# EAGLE schematic main_brd (EAGLE 6.4)
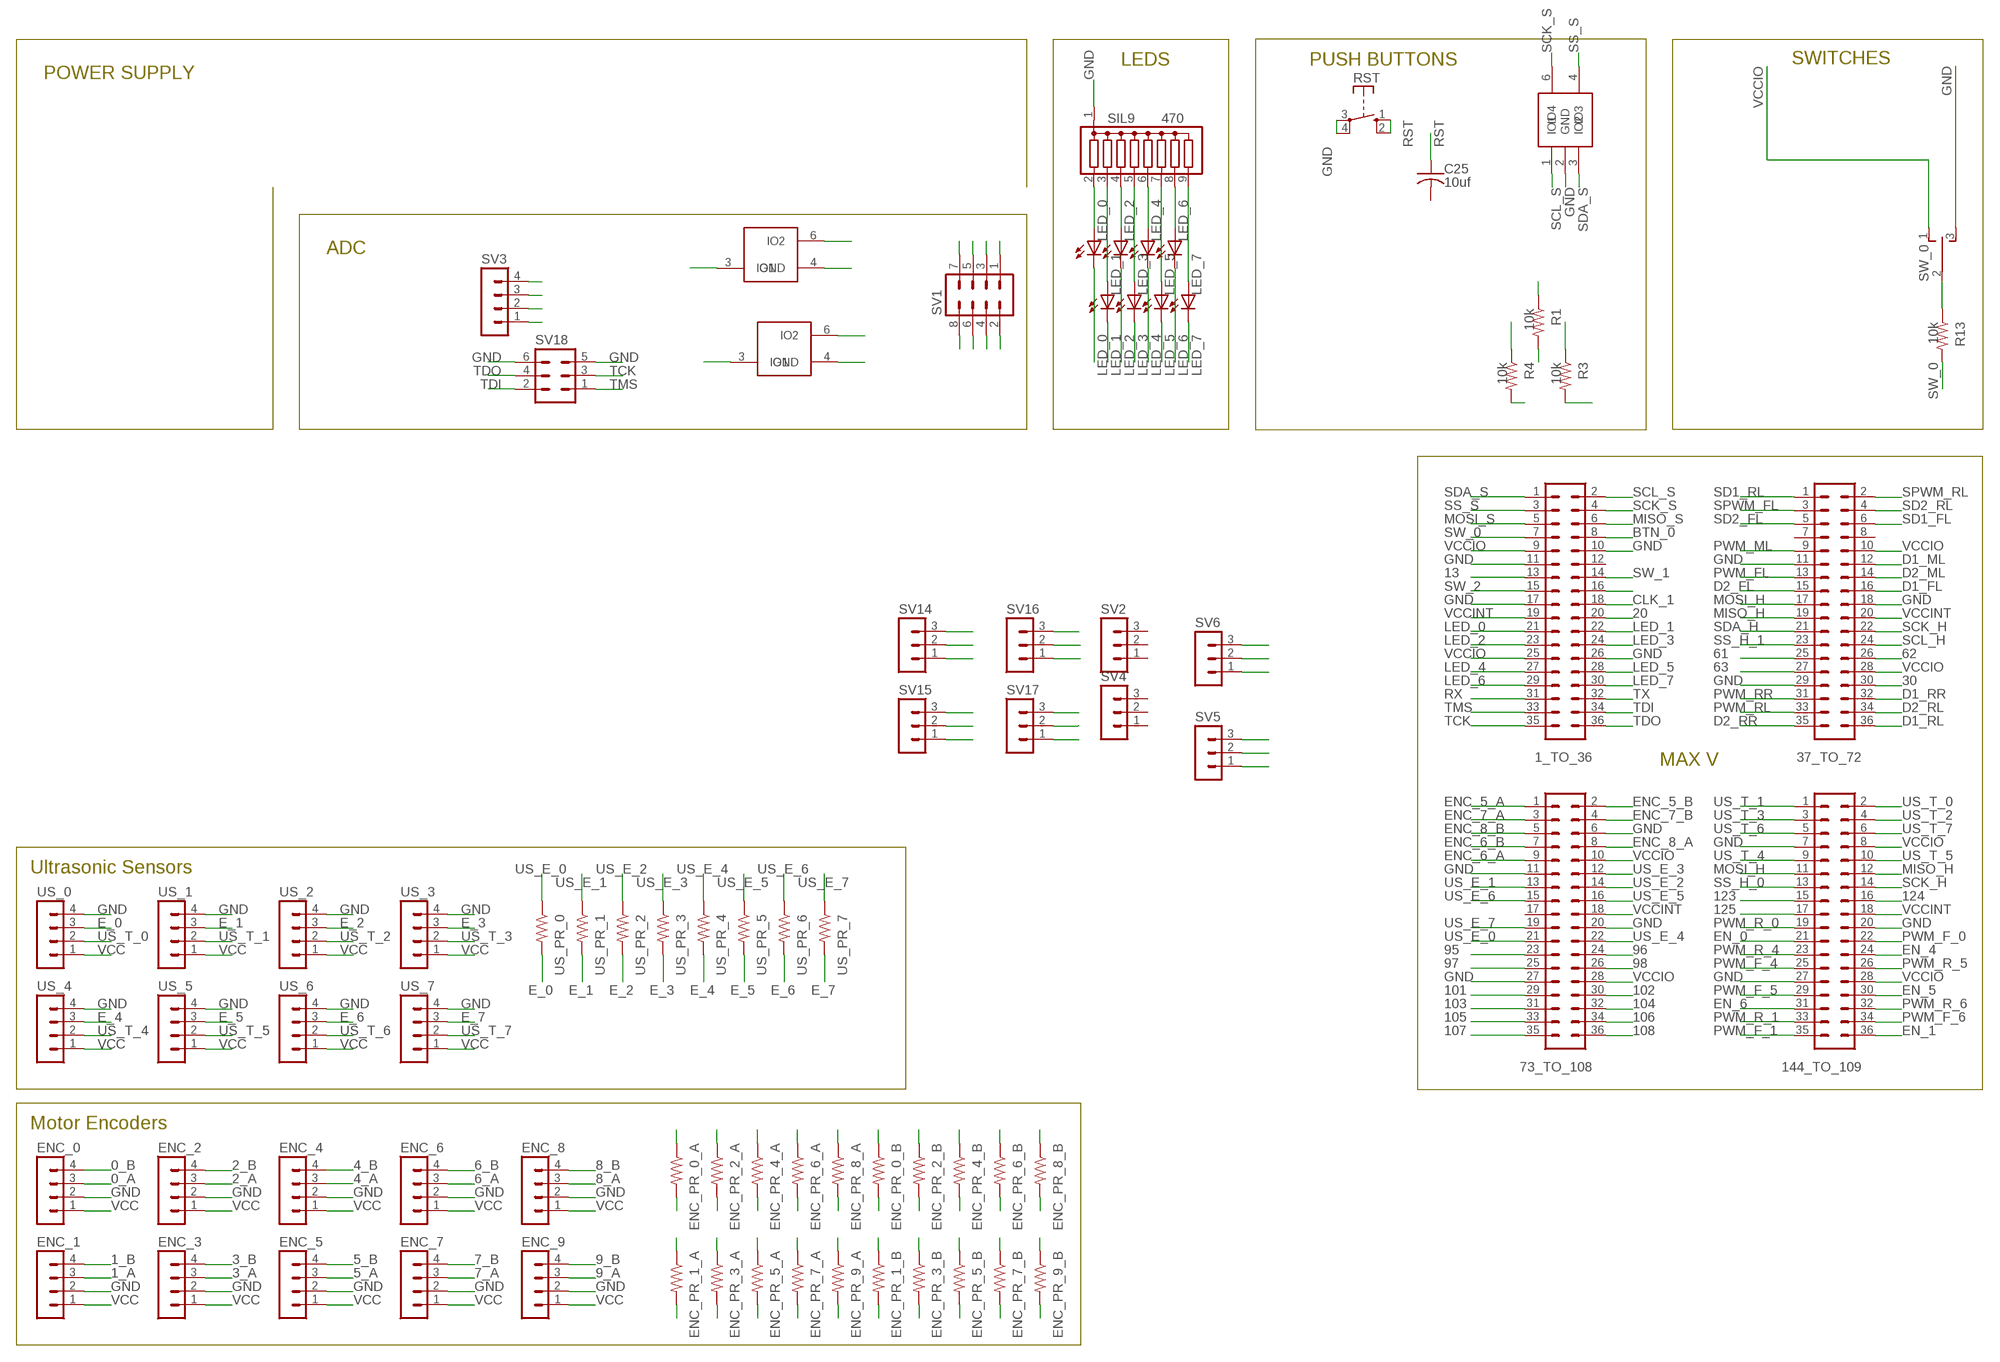
[diagram p0: schematic, sheet 1, part 1 of 2]
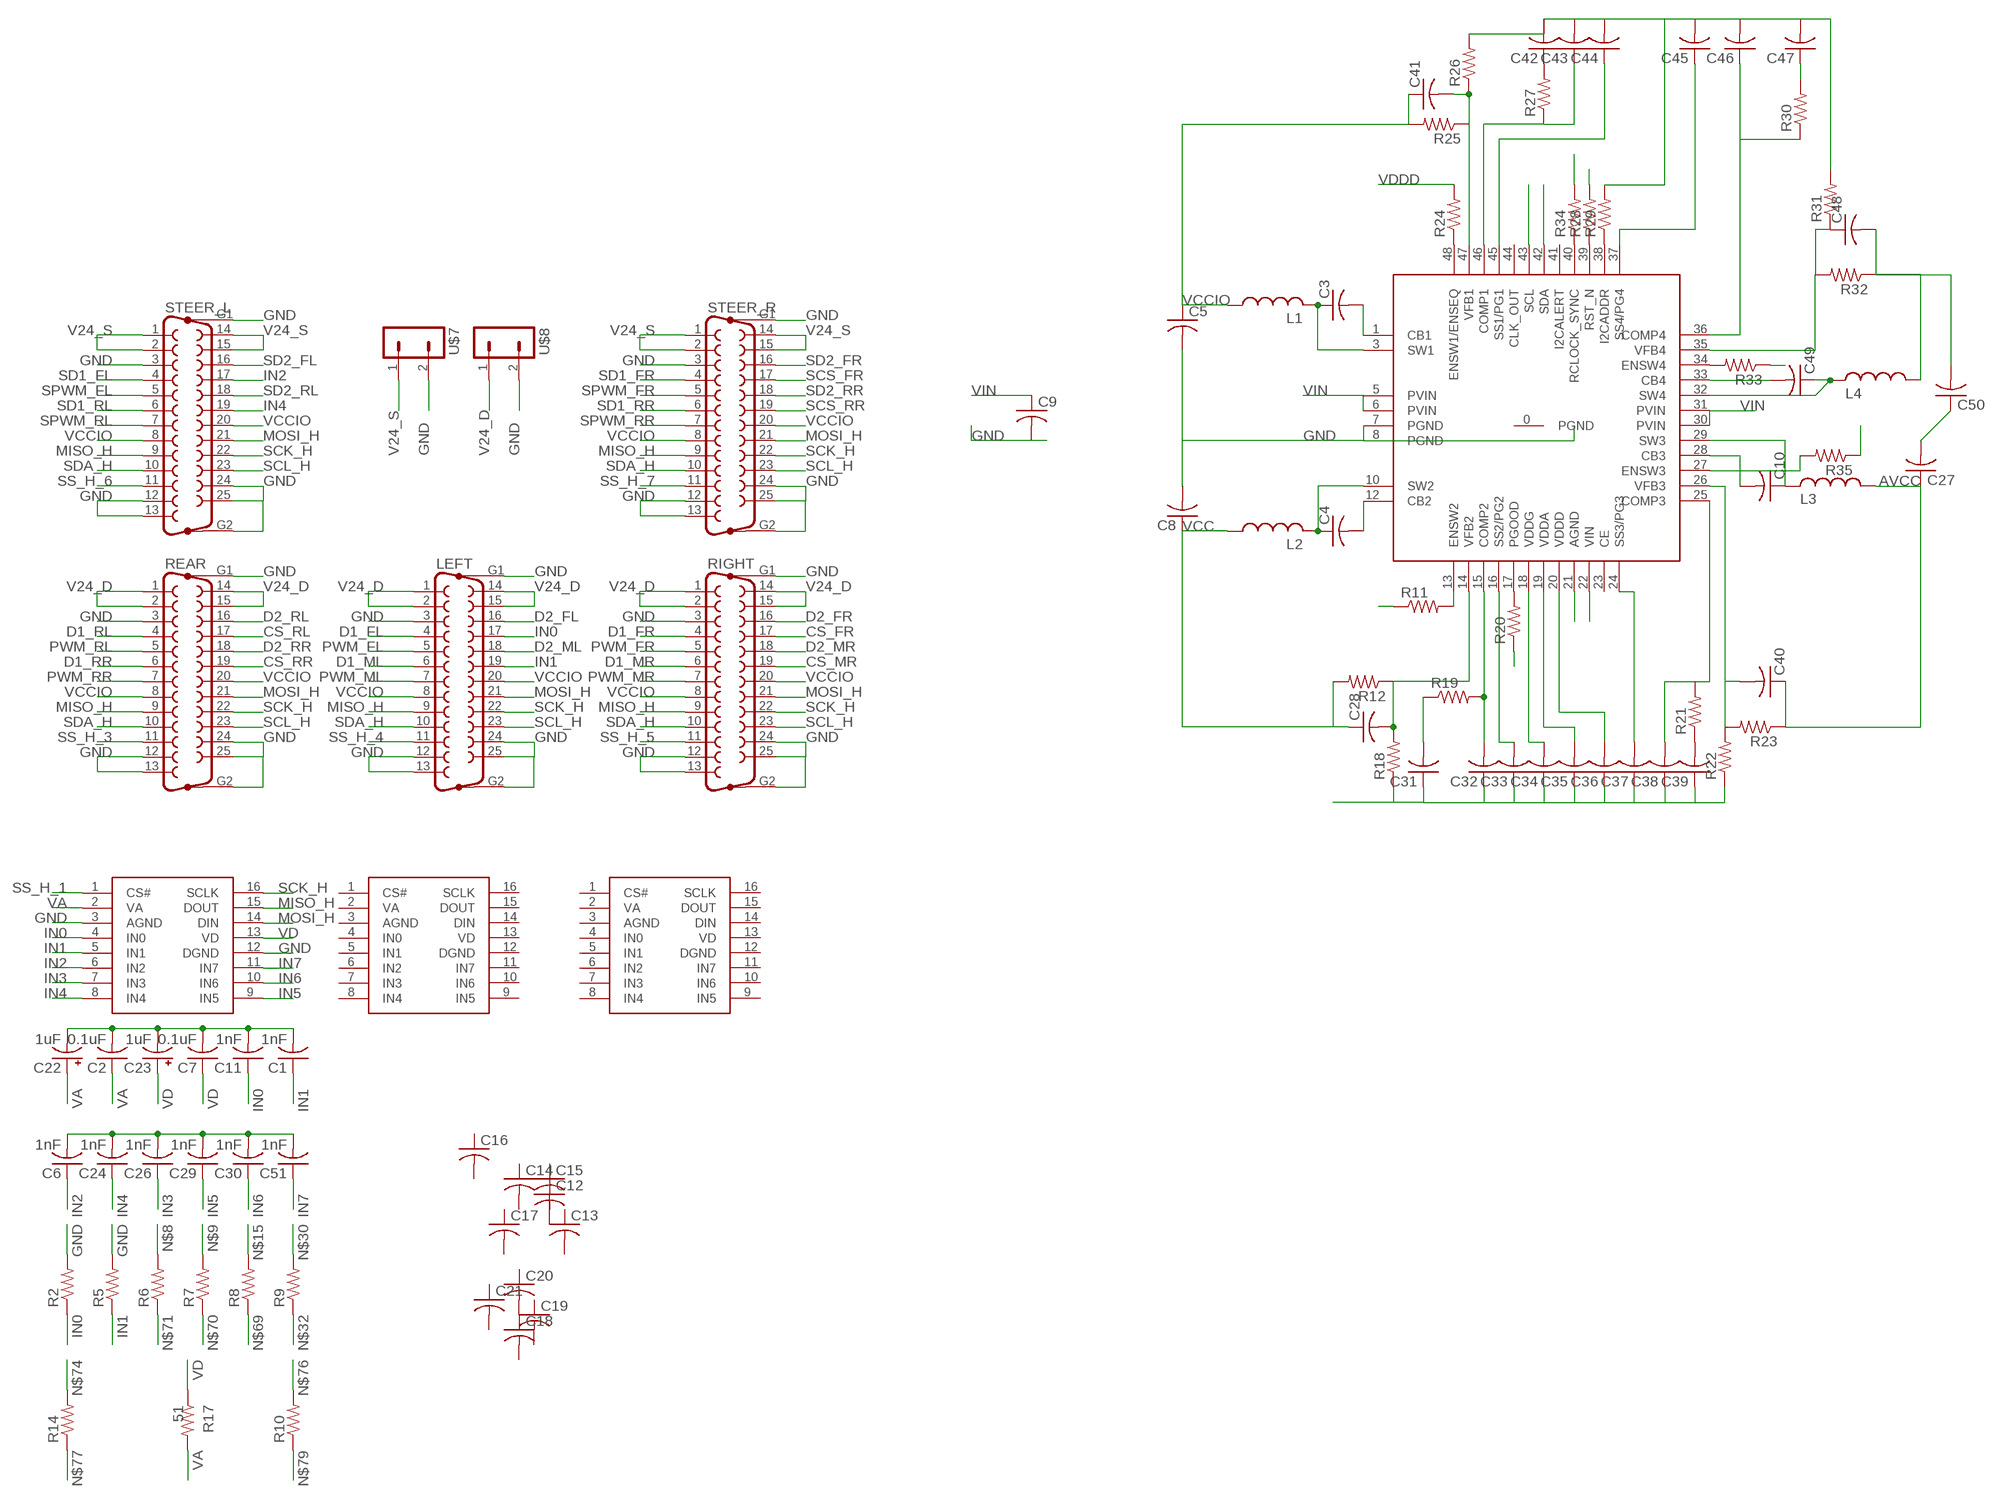
[diagram p1: schematic, sheet 1, part 2 of 2]

## Parts
1_TO_36  MA18-2  [MA18-2]
37_TO_72  MA18-2  [MA18-2]
73_TO_108  MA18-2  [MA18-2]
144_TO_109  MA18-2  [MA18-2]
C1  1nF  C-USC1206  [C1206]
C2  0.1uF  C-USC1206  [C1206]
C3  C-USC1206  [C1206]
C4  C-USC1206  [C1206]
C5  C-USC1206  [C1206]
C6  1nF  C-USC1206  [C1206]
C7  0.1uF  C-USC1206  [C1206]
C8  C-USC1206  [C1206]
C9  C-USC1206  [C1206]
C10  C-USC1206  [C1206]
C11  1nF  C-USC1206  [C1206]
C12  C-USC1206  [C1206]
C13  C-USC1206  [C1206]
C14  C-USC1206  [C1206]
C15  C-USC1206  [C1206]
C16  C-USC1206  [C1206]
C17  C-USC1206  [C1206]
C18  C-USC1206  [C1206]
C19  C-USC1206  [C1206]
C20  C-USC1206  [C1206]
C21  C-USC1206  [C1206]
C22  1uF  CPOL-USE1.8-4  [E1,8-4]
C23  1uF  CPOL-USE1.8-4  [E1,8-4]
C24  1nF  C-USC1206  [C1206]
C25  10uf  C-USC1206  [C1206]
C26  1nF  C-USC1206  [C1206]
C27  C-USC1206  [C1206]
C28  C-USC1206  [C1206]
C29  1nF  C-USC1206  [C1206]
C30  1nF  C-USC1206  [C1206]
C31  C-USC1206  [C1206]
C32  C-USC1206  [C1206]
C33  C-USC1206  [C1206]
C34  C-USC1206  [C1206]
C35  C-USC1206  [C1206]
C36  C-USC1206  [C1206]
C37  C-USC1206  [C1206]
C38  C-USC1206  [C1206]
C39  C-USC1206  [C1206]
C40  C-USC1206  [C1206]
C41  C-USC1206  [C1206]
C42  C-USC1206  [C1206]
C43  C-USC1206  [C1206]
C44  C-USC1206  [C1206]
C45  C-USC1206  [C1206]
C46  C-USC1206  [C1206]
C47  C-USC1206  [C1206]
C48  C-USC1206  [C1206]
C49  C-USC1206  [C1206]
C50  C-USC1206  [C1206]
C51  1nF  C-USC1206  [C1206]
ENC_0  MA04-1  [MA04-1]
ENC_1  MA04-1  [MA04-1]
ENC_2  MA04-1  [MA04-1]
ENC_3  MA04-1  [MA04-1]
ENC_4  MA04-1  [MA04-1]
ENC_5  MA04-1  [MA04-1]
ENC_6  MA04-1  [MA04-1]
ENC_7  MA04-1  [MA04-1]
ENC_8  MA04-1  [MA04-1]
ENC_9  MA04-1  [MA04-1]
ENC_PR_0_A  R-US_R1206  [R1206]
ENC_PR_0_B  R-US_R1206  [R1206]
ENC_PR_1_A  R-US_R1206  [R1206]
ENC_PR_1_B  R-US_R1206  [R1206]
ENC_PR_2_A  R-US_R1206  [R1206]
ENC_PR_2_B  R-US_R1206  [R1206]
ENC_PR_3_A  R-US_R1206  [R1206]
ENC_PR_3_B  R-US_R1206  [R1206]
ENC_PR_4_A  R-US_R1206  [R1206]
ENC_PR_4_B  R-US_R1206  [R1206]
ENC_PR_5_A  R-US_R1206  [R1206]
ENC_PR_5_B  R-US_R1206  [R1206]
ENC_PR_6_A  R-US_R1206  [R1206]
ENC_PR_6_B  R-US_R1206  [R1206]
ENC_PR_7_A  R-US_R1206  [R1206]
ENC_PR_7_B  R-US_R1206  [R1206]
ENC_PR_8_A  R-US_R1206  [R1206]
ENC_PR_8_B  R-US_R1206  [R1206]
ENC_PR_9_A  R-US_R1206  [R1206]
ENC_PR_9_B  R-US_R1206  [R1206]
L1  L-USL1206  [C1206]
L2  L-USL1206  [C1206]
L3  L-USL1206  [C1206]
L4  L-USL1206  [C1206]
LED_0  LEDSMT1206  [1206]
LED_1  LEDSMT1206  [1206]
LED_2  LEDSMT1206  [1206]
LED_3  LEDSMT1206  [1206]
LED_4  LEDSMT1206  [1206]
LED_5  LEDSMT1206  [1206]
LED_6  LEDSMT1206  [1206]
LED_7  LEDSMT1206  [1206]
LEFT  F25HP  [F25HP]
R1  10k  R-US_R1206  [R1206]
R2  R-US_0204/2V  [0204V]
R3  10k  R-US_R1206  [R1206]
R4  10k  R-US_R1206  [R1206]
R5  R-US_0204/2V  [0204V]
R6  R-US_0204/2V  [0204V]
R7  R-US_0204/2V  [0204V]
R8  R-US_0204/2V  [0204V]
R9  R-US_0204/2V  [0204V]
R10  R-US_0204/2V  [0204V]
R11  R-US_R1206  [R1206]
R12  R-US_R1206  [R1206]
R13  10k  R-US_R1206  [R1206]
R14  R-US_0204/2V  [0204V]
R17  51  R-US_R1206  [R1206]
R18  R-US_R1206  [R1206]
R19  R-US_R1206  [R1206]
R20  R-US_R1206  [R1206]
R21  R-US_R1206  [R1206]
R22  R-US_R1206  [R1206]
R23  R-US_R1206  [R1206]
R24  R-US_R1206  [R1206]
R25  R-US_R1206  [R1206]
R26  R-US_R1206  [R1206]
R27  R-US_R1206  [R1206]
R28  R-US_R1206  [R1206]
R29  R-US_R1206  [R1206]
R30  R-US_R1206  [R1206]
R31  R-US_R1206  [R1206]
R32  R-US_R1206  [R1206]
R33  R-US_R1206  [R1206]
R34  R-US_R1206  [R1206]
R35  R-US_R1206  [R1206]
REAR  F25HP  [F25HP]
RIGHT  F25HP  [F25HP]
RST  RACON12  [RACON12]
SIL9  470  G08R  [SIL9]
STEER_L  F25HP  [F25HP]
STEER_R  F25HP  [F25HP]
SV1  MA04-2  [MA04-2]
SV2  MA03-1  [MA03-1]
SV3  MA04-1  [MA04-1]
SV4  MA03-1  [MA03-1]
SV5  MA03-1  [MA03-1]
SV6  MA03-1  [MA03-1]
SV14  MA03-1  [MA03-1]
SV15  MA03-1  [MA03-1]
SV16  MA03-1  [MA03-1]
SV17  MA03-1  [MA03-1]
SV18  MA03-2  [MA03-2]
SW_0  TL39PO  [TL3XPO]
U$1  TPD4E1B06DCKR  [DCK6]
U$2  TPS65400RGZR  [VQFN48]
U$4  TPD2E2U06DRLR  [DRL5]
U$5  TPD2E2U06DRLR  [DRL5]
U$7  MB02-1  [MB03-1]
U$8  MB02-1  [MB03-1]
U$9  ADC128S052QCMT  [R-PDSO-G16]
U$10  ADC128S052QCMT  [R-PDSO-G16]
U$11  ADC128S052QCMT  [R-PDSO-G16]
US_0  MA04-1  [MA04-1]
US_1  MA04-1  [MA04-1]
US_2  MA04-1  [MA04-1]
US_3  MA04-1  [MA04-1]
US_4  MA04-1  [MA04-1]
US_5  MA04-1  [MA04-1]
US_6  MA04-1  [MA04-1]
US_7  MA04-1  [MA04-1]
US_PR_0  R-US_R1206  [R1206]
US_PR_1  R-US_R1206  [R1206]
US_PR_2  R-US_R1206  [R1206]
US_PR_3  R-US_R1206  [R1206]
US_PR_4  R-US_R1206  [R1206]
US_PR_5  R-US_R1206  [R1206]
US_PR_6  R-US_R1206  [R1206]
US_PR_7  R-US_R1206  [R1206]

## Nets
0_A: ENC_0.3 ENC_PR_0_A.2
0_B: ENC_0.4 ENC_PR_0_B.2
1_A: ENC_1.3 ENC_PR_1_A.2
1_B: ENC_1.4 ENC_PR_1_B.2
2_A: ENC_2.3 ENC_PR_2_A.2
2_B: ENC_2.4 ENC_PR_2_B.2
3_A: ENC_3.3 ENC_PR_3_A.2
3_B: ENC_3.4 ENC_PR_3_B.2
4_A: ENC_4.3 ENC_PR_4_A.2
4_B: ENC_4.4 ENC_PR_4_B.2
5_A: ENC_5.3 ENC_PR_5_A.2
5_B: ENC_5.4 ENC_PR_5_B.2
6_A: ENC_6.3 ENC_PR_6_A.2
6_B: ENC_6.4 ENC_PR_6_B.2
7_A: ENC_7.3 ENC_PR_7_A.2
7_B: ENC_7.4 ENC_PR_7_B.2
8_A: ENC_8.3 ENC_PR_8_A.2
8_B: ENC_8.4 ENC_PR_8_B.2
9_A: ENC_9.3 ENC_PR_9_A.2
9_B: ENC_9.4 ENC_PR_9_B.2
13: 1_TO_36.13
20: 1_TO_36.20
30: 37_TO_72.30
61: 37_TO_72.25
62: 37_TO_72.26
63: 37_TO_72.27
95: 73_TO_108.23
96: 73_TO_108.24
97: 73_TO_108.25
98: 73_TO_108.26
101: 73_TO_108.29
102: 73_TO_108.30
103: 73_TO_108.31
104: 73_TO_108.32
105: 73_TO_108.33
106: 73_TO_108.34
107: 73_TO_108.35
108: 73_TO_108.36
123: 144_TO_109.15
124: 144_TO_109.16
125: 144_TO_109.17
AVCC: C27.1 C40.1 L3.1 R23.1 SV5.1 SV6.1 SV14.1 SV15.1 SV16.1 SV17.1
BTN: U$4.6(IO2)
BTN_0: 1_TO_36.8
CLK_1: 1_TO_36.18
CS_FR: RIGHT.17
CS_MR: RIGHT.19
CS_RL: REAR.17
CS_RR: REAR.19
D1_FL: 37_TO_72.16 LEFT.4
D1_FR: RIGHT.4
D1_ML: 37_TO_72.12 LEFT.6
D1_MR: RIGHT.6
D1_RL: 37_TO_72.36 REAR.4
D1_RR: 37_TO_72.32 REAR.6
D2_FL: 37_TO_72.15 LEFT.16
D2_FR: RIGHT.16
D2_ML: 37_TO_72.14 LEFT.18
D2_MR: RIGHT.18
D2_RL: 37_TO_72.34 REAR.16
D2_RR: 37_TO_72.35 REAR.18
E_0: US_0.3 US_PR_0.2
E_1: US_1.3 US_PR_1.2
E_2: US_2.3 US_PR_2.2
E_3: US_3.3 US_PR_3.2
E_4: US_4.3 US_PR_4.2
E_5: US_5.3 US_PR_5.2
E_6: US_6.3 US_PR_6.2
E_7: US_7.3 US_PR_7.2
EN_0: 144_TO_109.21
EN_1: 144_TO_109.36
EN_4: 144_TO_109.24
EN_5: 144_TO_109.30
EN_6: 144_TO_109.31
ENC_0_A: ENC_PR_0_A.1
ENC_0_B: ENC_PR_0_B.1
ENC_1_A: ENC_PR_1_A.1
ENC_1_B: ENC_PR_1_B.1
ENC_2_A: ENC_PR_2_A.1
ENC_2_B: ENC_PR_2_B.1
ENC_3_A: ENC_PR_3_A.1
ENC_3_B: ENC_PR_3_B.1
ENC_4_A: ENC_PR_4_A.1
ENC_4_B: ENC_PR_4_B.1
ENC_5_A: 73_TO_108.1 ENC_PR_5_A.1
ENC_5_B: 73_TO_108.2 ENC_PR_5_B.1
ENC_6_A: 73_TO_108.9 ENC_PR_6_A.1
ENC_6_B: 73_TO_108.7 ENC_PR_6_B.1
ENC_7_A: 73_TO_108.3 ENC_PR_7_A.1
ENC_7_B: 73_TO_108.4 ENC_PR_7_B.1
ENC_8_A: 73_TO_108.8 ENC_PR_8_A.1
ENC_8_B: 73_TO_108.5 ENC_PR_8_B.1
ENC_9_A: ENC_PR_9_A.1
ENC_9_B: ENC_PR_9_B.1
ENSW3: R35.2 U$2.27(ENSW3)
ENSW4: R33.2 U$2.34(ENSW4)
GND: 1_TO_36.10 1_TO_36.11 1_TO_36.17 1_TO_36.26 37_TO_72.11 37_TO_72.18 37_TO_72.29 73_TO_108.6 73_TO_108.11 73_TO_108.20 73_TO_108.27 144_TO_109.7 144_TO_109.20 144_TO_109.27 C1.2 C2.2 C5.2 C6.2 C7.2 C8.2 C9.2 C11.2 C22.- C23.- C24.2 C26.2 C27.2 C29.2 C30.2 C31.1 C32.1 C33.1 C34.1 C35.1 C36.1 C37.1 C38.1 C39.1 C42.2 C43.2 C44.2 C45.2 C46.2 C47.2 C51.2 ENC_0.2 ENC_1.2 ENC_2.2 ENC_3.2 ENC_4.2 ENC_5.2 ENC_6.2 ENC_7.2 ENC_8.2 ENC_9.2 LEFT.3 LEFT.12 LEFT.13 LEFT.24 LEFT.25 LEFT.G1 LEFT.G2 R2.2 R5.2 R18.1 R22.1 R26.2 R29.2 R31.2 R34.2 REAR.3 REAR.12 REAR.13 REAR.24 REAR.25 REAR.G1 REAR.G2 RIGHT.3 RIGHT.12 RIGHT.13 RIGHT.24 RIGHT.25 RIGHT.G1 RIGHT.G2 RST.3(P) RST.4(P) SIL9.1 STEER_L.3 STEER_L.12 STEER_L.13 STEER_L.24 STEER_L.25 STEER_L.G1 STEER_L.G2 STEER_R.3 STEER_R.12 STEER_R.13 STEER_R.24 STEER_R.25 STEER_R.G1 STEER_R.G2 SV1.7 SV1.8 SV3.2 SV5.3 SV6.3 SV14.3 SV15.3 SV16.3 SV17.3 SV18.5 SV18.6 SW_0.3(S) U$1.2(GND) U$2.7(PGND) U$2.8(PGND) U$2.21(AGND) U$4.4(GND) U$5.4(GND) U$7.2 U$8.2 U$9.3(AGND) U$9.12(DGND) US_0.4 US_1.4 US_2.4 US_3.4 US_4.4 US_5.4 US_6.4 US_7.4
IN0: C11.1 LEFT.17 R2.1 U$9.4(IN0)
IN1: C1.1 LEFT.19 R5.1 U$9.5(IN1)
IN2: C6.1 STEER_L.17 U$9.6(IN2)
IN3: C26.1 SV5.2 U$9.7(IN3)
IN4: C24.1 STEER_L.19 U$9.8(IN4)
IN5: C29.1 SV16.2 U$9.9(IN5)
IN6: C30.1 SV6.2 U$9.10(IN6)
IN7: C51.1 SV17.2 U$9.11(IN7)
LED_0: 1_TO_36.21 LED_0.C
LED_1: 1_TO_36.22 LED_1.C
LED_2: 1_TO_36.23 LED_2.C
LED_3: 1_TO_36.24 LED_3.C
LED_4: 1_TO_36.27 LED_4.C
LED_5: 1_TO_36.28 LED_5.C
LED_6: 1_TO_36.29 LED_6.C
LED_7: 1_TO_36.30 LED_7.C
MISO_H: 37_TO_72.19 144_TO_109.12 LEFT.9 REAR.9 RIGHT.9 STEER_L.9 STEER_R.9 U$9.15(DOUT)
MISO_S: 1_TO_36.6 SV1.5 U$5.3(IO1)
MOSI_H: 37_TO_72.17 144_TO_109.11 LEFT.21 REAR.21 RIGHT.21 STEER_L.21 STEER_R.21 U$9.14(DIN)
MOSI_S: 1_TO_36.5 SV1.6 U$5.6(IO2)
N$3: C4.1 L2.2 U$2.10(SW2)
N$4: C18.1 C20.2
N$8: R6.2
N$9: R7.2
N$10: C3.2 U$2.1(CB1)
N$11: C3.1 L1.2 U$2.3(SW1)
N$12: C4.2 U$2.12(CB2)
N$13: C10.1 L3.2 U$2.29(SW3)
N$14: C10.2 U$2.28(CB3)
N$15: R8.2
N$16: R11.2 U$2.13(ENSW2)
N$17: C28.2 R12.1 R18.2 U$2.14(VFB2)
N$18: C32.2 R19.2 U$2.15(COMP2)
N$19: LED_0.A SIL9.2
N$21: LED_4.A SIL9.6
N$22: LED_6.A SIL9.8
N$23: LED_1.A SIL9.3
N$24: LED_3.A SIL9.5
N$25: LED_5.A SIL9.7
N$26: LED_7.A SIL9.9
N$27: C31.2 R19.1
N$28: R13.1 SW_0.2(P)
N$29: R20.2 U$2.17(PGOOD)
N$30: R9.2
N$32: R9.1
N$35: C34.2 U$2.18(VDDG)
N$36: C35.2 U$2.19(VDDA)
N$37: C39.2 R21.1
N$38: C40.2 R22.2 R23.2 U$2.26(VFB3)
N$39: C38.2 R21.2 U$2.25(COMP3)
N$40: R24.1 U$2.48(ENSW1/ENSEQ)
N$41: C37.2 U$2.24(SS3/PG3)
N$44: C33.2 U$2.16(SS2/PG2)
N$47: C42.1 R27.2
N$54: R29.1 U$2.38(I2CADDR)
N$55: C48.1 R31.1 R32.2 U$2.35(VFB4)
N$57: C49.1 L4.2 U$2.32(SW4)
N$58: C41.2 R25.1 R26.1 U$2.47(VFB1)
N$59: C45.1 U$2.37(SS4/PG4)
N$60: C46.1 R30.1 U$2.36(COMP4)
N$61: C47.1 R30.2
N$62: C43.1 R27.1 U$2.46(COMP1)
N$63: C44.1 U$2.45(SS1/PG1)
N$65: C49.2 U$2.33(CB4)
N$66: R34.1 U$2.40(RCLOCK_SYNC)
N$69: R8.1
N$70: R7.1
N$71: R6.1
N$74: R14.2
N$76: R10.2
N$77: R14.1
N$79: R10.1
POT_0: SV14.2
POT_1: SV15.2
PWM_F_0: 144_TO_109.22
PWM_F_1: 144_TO_109.35
PWM_F_4: 144_TO_109.25
PWM_F_5: 144_TO_109.29
PWM_F_6: 144_TO_109.34
PWM_FL: 37_TO_72.13 LEFT.5
PWM_FR: RIGHT.5
PWM_ML: 37_TO_72.9 LEFT.7
PWM_MR: RIGHT.7
PWM_R_0: 144_TO_109.19
PWM_R_1: 144_TO_109.33
PWM_R_4: 144_TO_109.23
PWM_R_5: 144_TO_109.26
PWM_R_6: 144_TO_109.32
PWM_RL: 37_TO_72.33 REAR.5
PWM_RR: 37_TO_72.31 REAR.7
RST: C25.1 R1.1 RST.1(S) RST.2(S) U$4.3(IO1)
RST_N: R28.1 U$2.39(RST_N)
RX: 1_TO_36.31 SV3.3
SCK_H: 37_TO_72.22 144_TO_109.14 LEFT.22 REAR.22 RIGHT.22 STEER_L.22 STEER_R.22 U$9.16(SCLK)
SCK_S: 1_TO_36.4 SV1.3 U$1.6(IO4)
SCL_H: 37_TO_72.24 LEFT.23 REAR.23 RIGHT.23 STEER_L.23 STEER_R.23
SCL_S: 1_TO_36.2 R4.1 SV1.1 U$1.1(IO1) U$2.43(SCL)
SCS_FR: STEER_R.17
SCS_RR: STEER_R.19
SD1_FL: 37_TO_72.6 STEER_L.4
SD1_FR: STEER_R.4
SD1_RL: 37_TO_72.1 STEER_L.6
SD1_RR: STEER_R.6
SD2_FL: 37_TO_72.5 STEER_L.16
SD2_FR: STEER_R.16
SD2_RL: 37_TO_72.4 STEER_L.18
SD2_RR: STEER_R.18
SDA_H: 37_TO_72.21 LEFT.10 REAR.10 RIGHT.10 STEER_L.10 STEER_R.10
SDA_S: 1_TO_36.1 R3.1 SV1.2 U$1.3(IO2) U$2.42(SDA)
SIL10: LED_2.A SIL9.4
SPWM_FL: 37_TO_72.3 STEER_L.5
SPWM_FR: STEER_R.5
SPWM_RL: 37_TO_72.2 STEER_L.7
SPWM_RR: STEER_R.7
SS_H_0: 144_TO_109.13
SS_H_1: 37_TO_72.23 U$9.1(CS#)
SS_H_3: REAR.11
SS_H_4: LEFT.11
SS_H_5: RIGHT.11
SS_H_6: STEER_L.11
SS_H_7: STEER_R.11
SS_S: 1_TO_36.3 SV1.4 U$1.4(IO3)
SW_0: 1_TO_36.7 R13.2
SW_1: 1_TO_36.14
SW_2: 1_TO_36.15
SW_3: 1_TO_36.16
TCK: 1_TO_36.35 SV18.3
TDI: 1_TO_36.34 SV18.2
TDO: 1_TO_36.36 SV18.4
TMS: 1_TO_36.33 SV18.1
TX: 1_TO_36.32 SV3.1
US_E_0: 73_TO_108.21 US_PR_0.1
US_E_1: 73_TO_108.13 US_PR_1.1
US_E_2: 73_TO_108.14 US_PR_2.1
US_E_3: 73_TO_108.12 US_PR_3.1
US_E_4: 73_TO_108.22 US_PR_4.1
US_E_5: 73_TO_108.16 US_PR_5.1
US_E_6: 73_TO_108.15 US_PR_6.1
US_E_7: 73_TO_108.19 US_PR_7.1
US_T_0: 144_TO_109.2 US_0.2
US_T_1: 144_TO_109.1 US_1.2
US_T_2: 144_TO_109.4 US_2.2
US_T_3: 144_TO_109.3 US_3.2
US_T_4: 144_TO_109.9 US_4.2
US_T_5: 144_TO_109.10 US_5.2
US_T_6: 144_TO_109.5 US_6.2
US_T_7: 144_TO_109.6 US_7.2
V24_D: LEFT.1 LEFT.2 LEFT.14 LEFT.15 REAR.1 REAR.2 REAR.14 REAR.15 RIGHT.1 RIGHT.2 RIGHT.14 RIGHT.15 U$8.1
V24_S: STEER_L.1 STEER_L.2 STEER_L.14 STEER_L.15 STEER_R.1 STEER_R.2 STEER_R.14 STEER_R.15 U$7.1
VA: C2.1 C22.+ R17.2 U$9.2(VA)
VCC: C8.1 C28.1 ENC_0.1 ENC_1.1 ENC_2.1 ENC_3.1 ENC_4.1 ENC_5.1 ENC_6.1 ENC_7.1 ENC_8.1 ENC_9.1 L2.1 R12.2 US_0.1 US_1.1 US_2.1 US_3.1 US_4.1 US_5.1 US_6.1 US_7.1
VCCINT: 1_TO_36.19 37_TO_72.20 73_TO_108.18 144_TO_109.18 C48.2 C50.2 L4.1 R32.1
VCCIO: 1_TO_36.9 1_TO_36.25 37_TO_72.10 37_TO_72.28 73_TO_108.10 73_TO_108.28 144_TO_109.8 144_TO_109.28 C5.1 C41.1 L1.1 LEFT.8 LEFT.20 R1.2 R3.2 R4.2 R25.2 REAR.8 REAR.20 RIGHT.8 RIGHT.20 STEER_L.8 STEER_L.20 STEER_R.8 STEER_R.20 SV3.4 SW_0.1(O)
VD: C7.1 C23.+ R17.1 U$9.13(VD)
VDDD: C36.2 R11.1 R20.1 R24.2 R28.2 R33.1 R35.1 U$2.20(VDDD)
VIN: C9.1 U$2.5(PVIN) U$2.6(PVIN) U$2.22(VIN) U$2.30(PVIN) U$2.31(PVIN)
Unconnected: 1_TO_36.12 37_TO_72.7 37_TO_72.8 73_TO_108.17 C12.1 C12.2 C13.1 C13.2 C14.1 C14.2 C15.1 C15.2 C16.1 C16.2 C17.1 C17.2 C18.2 C19.1 C19.2 C20.1 C21.1 C21.2 C25.2 C50.1 SV2.1 SV2.2 SV2.3 SV4.1 SV4.2 SV4.3 U$2.0(PGND) U$2.23(CE) U$2.41(I2CALERT) U$2.44(CLK_OUT) U$10.1(CS#) U$10.2(VA) U$10.3(AGND) U$10.4(IN0) U$10.5(IN1) U$10.6(IN2) U$10.7(IN3) U$10.8(IN4) U$10.9(IN5) U$10.10(IN6) U$10.11(IN7) U$10.12(DGND) U$10.13(VD) U$10.14(DIN) U$10.15(DOUT) U$10.16(SCLK) U$11.1(CS#) U$11.2(VA) U$11.3(AGND) U$11.4(IN0) U$11.5(IN1) U$11.6(IN2) U$11.7(IN3) U$11.8(IN4) U$11.9(IN5) U$11.10(IN6) U$11.11(IN7) U$11.12(DGND) U$11.13(VD) U$11.14(DIN) U$11.15(DOUT) U$11.16(SCLK)

## Notes on the sheet
- LEDS | PUSH BUTTONS | SWITCHES
- POWER SUPPLY
- ADC
- MAX V
- Ultrasonic Sensors
- Motor Encoders

## Library data of the parts
1_TO_36 37_TO_72 73_TO_108 144_TO_109 = con-lstb:MA18-2: PIN HEADER; OC_FARNELL: unknown; OC_NEWARK: unknown
C1-C21 C24 C26-C51 = rcl:C-US: CAPACITOR, American symbol
C22 C23 = resistor:CPOL-US: POLARIZED CAPACITOR, American symbol
C25 = resistor:C-US: CAPACITOR, American symbol
ENC_0 ENC_1-ENC_9 SV3 US_0 US_1-US_7 = con-lstb:MA04-1: PIN HEADER; OC_FARNELL: unknown; OC_NEWARK: unknown
ENC_PR_0_A ENC_PR_0_B ENC_PR_1_A ENC_PR_1_B ENC_PR_2_A ENC_PR_2_B ENC_PR_3_A ENC_PR_3_B ENC_PR_4_A ENC_PR_4_B ENC_PR_5_A ENC_PR_5_B ENC_PR_6_A ENC_PR_6_B ENC_PR_7_A ENC_PR_7_B ENC_PR_8_A ENC_PR_8_B ENC_PR_9_A ENC_PR_9_B R1 R3 R4 R13 R17 US_PR_0 US_PR_1-US_PR_7 = resistor:R-US_: RESISTOR, American symbol
L1-L4 = rcl:L-US: INDUCTOR, American symbol
LED_0 LED_1-LED_7 = led:LED: LED OSRAM: - CHIPLED LG R971, LG N971, LY N971, LG Q971, LY Q971, LO R971, LY R971 LH N974, LH R974 LS Q976, LO Q976, LY Q976 LO Q996 - Hyper CHIPLED LW Q18S LB Q993, LB Q99A, LB R99A - SideLED LS A670, LO A670, LY A670, LG A670, LP A670 LB A673, LV A673, LT A673, LW A673 LH A674 LY A675 LS A676, LA A676, LO A676, LY A676, LW A676 LS A679, LY A679, LG A679 - Hyper Micro SIDELED® LS Y876, LA Y876, LO Y876, LY Y876 LT Y87S - SmartLED LW L88C, LW L88S LB L89C, LB L89S, LG L890 LS L89K, LO L89K, LY L89K LS L896, LA L896, LO L896, LY L896 - TOPLED LS T670, LO T670, LY T670, LG T670, LP T670 LSG T670, LSP T670, LSY T670, LOP T670, LYG T670 LG T671, LOG T671, LSG T671 LB T673, LV T673, LT T673, LW T673 LH T674 LS T676, LA T676, LO T676, LY T676, LB T676, LH T676, LSB T676, LW T676 LB T67C, LV T67C, LT T67C, LS T67K, LO T67K, LY T67K, LW E67C LS E67B, LA E67B, LO E67B, LY E67B, LB E67C, LV E67C, LT E67C LW T67C LS T679, LY T679, LG T679 LS T770, LO T770, LY T770, LG T770, LP T770 LB T773, LV T773, LT T773, LW T773 LH T774 LS E675, LA E675, LY E675, LS T675 LS T776, LA T776, LO T776, LY T776, LB T776 LHGB T686 LT T68C, LB T68C - Hyper Mini TOPLED® LB M676 - Mini TOPLED Santana® LG M470 LS M47K, LO M47K, LY M47K Source: http://www.osram.convergy.de - LUMILED® LXK2-PW12-R00, LXK2-PW12-S00, LXK2-PW14-U00, LXK2-PW14-V00 LXK2-PM12-R00, LXK2-PM12-S00, LXK2-PM14-U00 LXK2-PE12-Q00, LXK2-PE12-R00, LXK2-PE12-S00, LXK2-PE14-T00, LXK2-PE14-U00 LXK2-PB12-K00, LXK2-PB12-L00, LXK2-PB12-M00, LXK2-PB14-N00, LXK2-PB14-P00, LXK2-PB14-Q00 LXK2-PR12-L00, LXK2-PR12-M00, LXK2-PR14-Q00, LXK2-PR14-R00 LXK2-PD12-Q00, LXK2-PD12-R00, LXK2-PD12-S00 LXK2-PH12-R00, LXK2-PH12-S00 LXK2-PL12-P00, LXK2-PL12-Q00, LXK2-PL12-R00 Source: www.luxeon.com
LEFT REAR RIGHT STEER_L STEER_R = con-subd:F25HP: SUB-D; OC_FARNELL: unknown; OC_NEWARK: unknown
R2 R5-R12 R14 R18-R35 = rcl:R-US_: RESISTOR, American symbol
RST = switch-misc:RACON12: ITT SWITCH
SIL9 = resistor-sil:G08R: SIL RESISTOR
SV1 = con-lstb:MA04-2: PIN HEADER; OC_FARNELL: unknown; OC_NEWARK: unknown
SV2 SV4-SV6 SV14-SV17 = con-lstb:MA03-1: PIN HEADER; OC_FARNELL: unknown; OC_NEWARK: unknown
SV18 = con-lstb:MA03-2: PIN HEADER; OC_FARNELL: unknown; OC_NEWARK: unknown
SW_0 = switch:TL39PO: TINY SWITCH ON OFF ON Source: http://www2.produktinfo.conrad.com/datenblaetter/700000-724999/705152-da-01-de-Subminiaturschalter_TL_36YO.pdf
U$1 = ti-esd:TPD4E1B06: Texas Intstruments ESD Protection Solutions
U$2 = ti-power:TPS65400: Quad 4A/4A/2A/2A buck converter
U$4 U$5 = ti-esd:TPD2E2U06: Texas Intstruments ESD Protection Solutions
U$7 U$8 = kamal:MB02-1
U$9-U$11 = kamal:ADC128S052